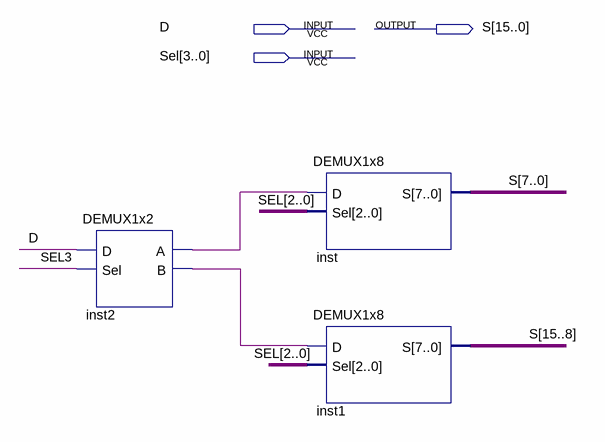
[diagram p0: schematic sheet]
// Quartus schematic DEMUX1x16.bdf as structural Verilog: 3 symbols, 3 pins
module DEMUX1x16 (
  input  D,
  input  [3:0] Sel,
  output [15:0] S
);

  wire inst2_a, inst2_b;

  DEMUX1x2 inst2 (.D(D), .Sel(Sel[3]), .A(inst2_a), .B(inst2_b));
  DEMUX1x8 inst (.D(inst2_a), .Sel(Sel[2:0]), .S(S[7:0]));
  DEMUX1x8 inst1 (.D(inst2_b), .Sel(Sel[2:0]), .S(S[15:8]));
endmodule
